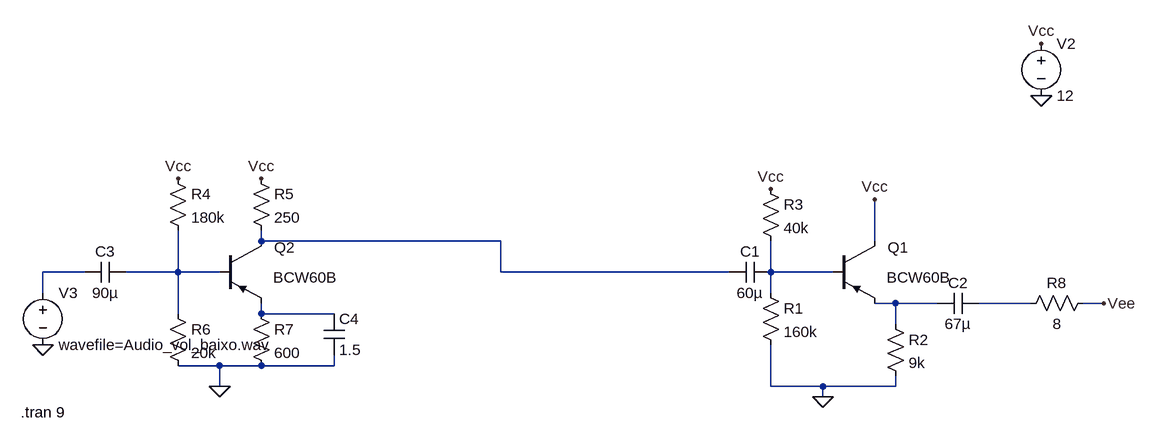
[diagram p0: schematic CircuitoCompleto.asc]
CircuitoCompleto.asc, the LTspice schematic file:
Version 4
SHEET 1 880 680
WIRE -528 80 -528 64
WIRE -160 80 -528 80
WIRE 416 80 416 16
WIRE -800 128 -864 128
WIRE -656 128 -656 64
WIRE -656 128 -736 128
WIRE -592 128 -656 128
WIRE -160 128 -160 80
WIRE 192 128 -160 128
WIRE 256 128 256 80
WIRE 352 128 256 128
WIRE -864 160 -864 128
WIRE 256 160 256 128
WIRE 448 176 416 176
WIRE 512 176 448 176
WIRE 656 176 576 176
WIRE 768 176 736 176
WIRE -656 192 -656 128
WIRE -528 192 -528 176
WIRE -416 192 -528 192
WIRE 448 208 448 176
WIRE -592 272 -656 272
WIRE -528 272 -592 272
WIRE -416 272 -416 256
WIRE -416 272 -528 272
WIRE -592 304 -592 272
WIRE 256 304 256 240
WIRE 336 304 256 304
WIRE 448 304 448 288
WIRE 448 304 336 304
WIRE 336 320 336 304
FLAG 336 320 0
FLAG 256 0 Vcc
FLAG 416 16 Vcc
FLAG 768 176 Vee
FLAG 672 -144 0
FLAG 672 -224 Vcc
FLAG -592 304 0
FLAG -656 -16 Vcc
FLAG -528 -16 Vcc
FLAG -864 240 0
SYMBOL cap 256 112 R90
WINDOW 0 0 32 VBottom 2
WINDOW 3 32 32 VTop 2
SYMATTR InstName C1
SYMATTR Value 60µ
SYMBOL res 240 144 R0
SYMATTR InstName R1
SYMATTR Value 160k
SYMBOL res 432 192 R0
SYMATTR InstName R2
SYMATTR Value 9k
SYMBOL pnp 352 80 R0
WINDOW 0 84 10 Left 2
WINDOW 3 82 56 Left 2
SYMATTR InstName Q1
SYMATTR Value BCW60B
SYMBOL res 240 -16 R0
SYMATTR InstName R3
SYMATTR Value 40k
SYMBOL voltage 672 -240 R0
WINDOW 123 0 0 Left 0
WINDOW 39 0 0 Left 0
SYMATTR InstName V2
SYMATTR Value 12
SYMBOL cap 576 160 R90
WINDOW 0 0 32 VBottom 2
WINDOW 3 32 32 VTop 2
SYMATTR InstName C2
SYMATTR Value 67µ
SYMBOL voltage -864 144 R0
SYMATTR InstName V3
SYMATTR Value wavefile=Audio_vol_baixo.wav
SYMBOL cap -736 112 R90
WINDOW 0 0 32 VBottom 2
WINDOW 3 32 32 VTop 2
SYMATTR InstName C3
SYMATTR Value 90µ
SYMBOL res -672 -32 R0
SYMATTR InstName R4
SYMATTR Value 180k
SYMBOL res -544 -32 R0
SYMATTR InstName R5
SYMATTR Value 250
SYMBOL res -672 176 R0
SYMATTR InstName R6
SYMATTR Value 20k
SYMBOL res -544 176 R0
SYMATTR InstName R7
SYMATTR Value 600
SYMBOL cap -432 192 R0
SYMATTR InstName C4
SYMATTR Value 1.5
SYMBOL pnp -592 80 R0
WINDOW 0 84 10 Left 2
WINDOW 3 82 56 Left 2
SYMATTR InstName Q2
SYMATTR Value BCW60B
SYMBOL res 752 160 R90
WINDOW 0 0 56 VBottom 2
WINDOW 3 32 56 VTop 2
SYMATTR InstName R8
SYMATTR Value 8
TEXT -898 344 Left 2 !.tran 9

The netlist it stands for:
* CircuitoCompleto.asc
C1 N004 N001 60µ
R1 N004 0 160k
R2 N005 0 9k
Q1 Vcc N004 N005 0 BCW60B
R3 Vcc N004 40k
V2 Vcc 0 12
C2 N006 N005 67µ
V3 N002 0 wavefile=Audio_vol_baixo.wav
C3 N003 N002 90µ
R4 Vcc N003 180k
R5 Vcc N001 250
R6 N003 0 20k
R7 N007 0 600
C4 N007 0 1.5
Q2 N001 N003 N007 0 BCW60B
R8 Vee N006 8
.model NPN NPN
.model PNP PNP
.lib standard.bjt
.tran 9
.backanno
.end